# EAGLE design Attenuverting_LinExp_VCA_Top (EAGLE 8.3.2)
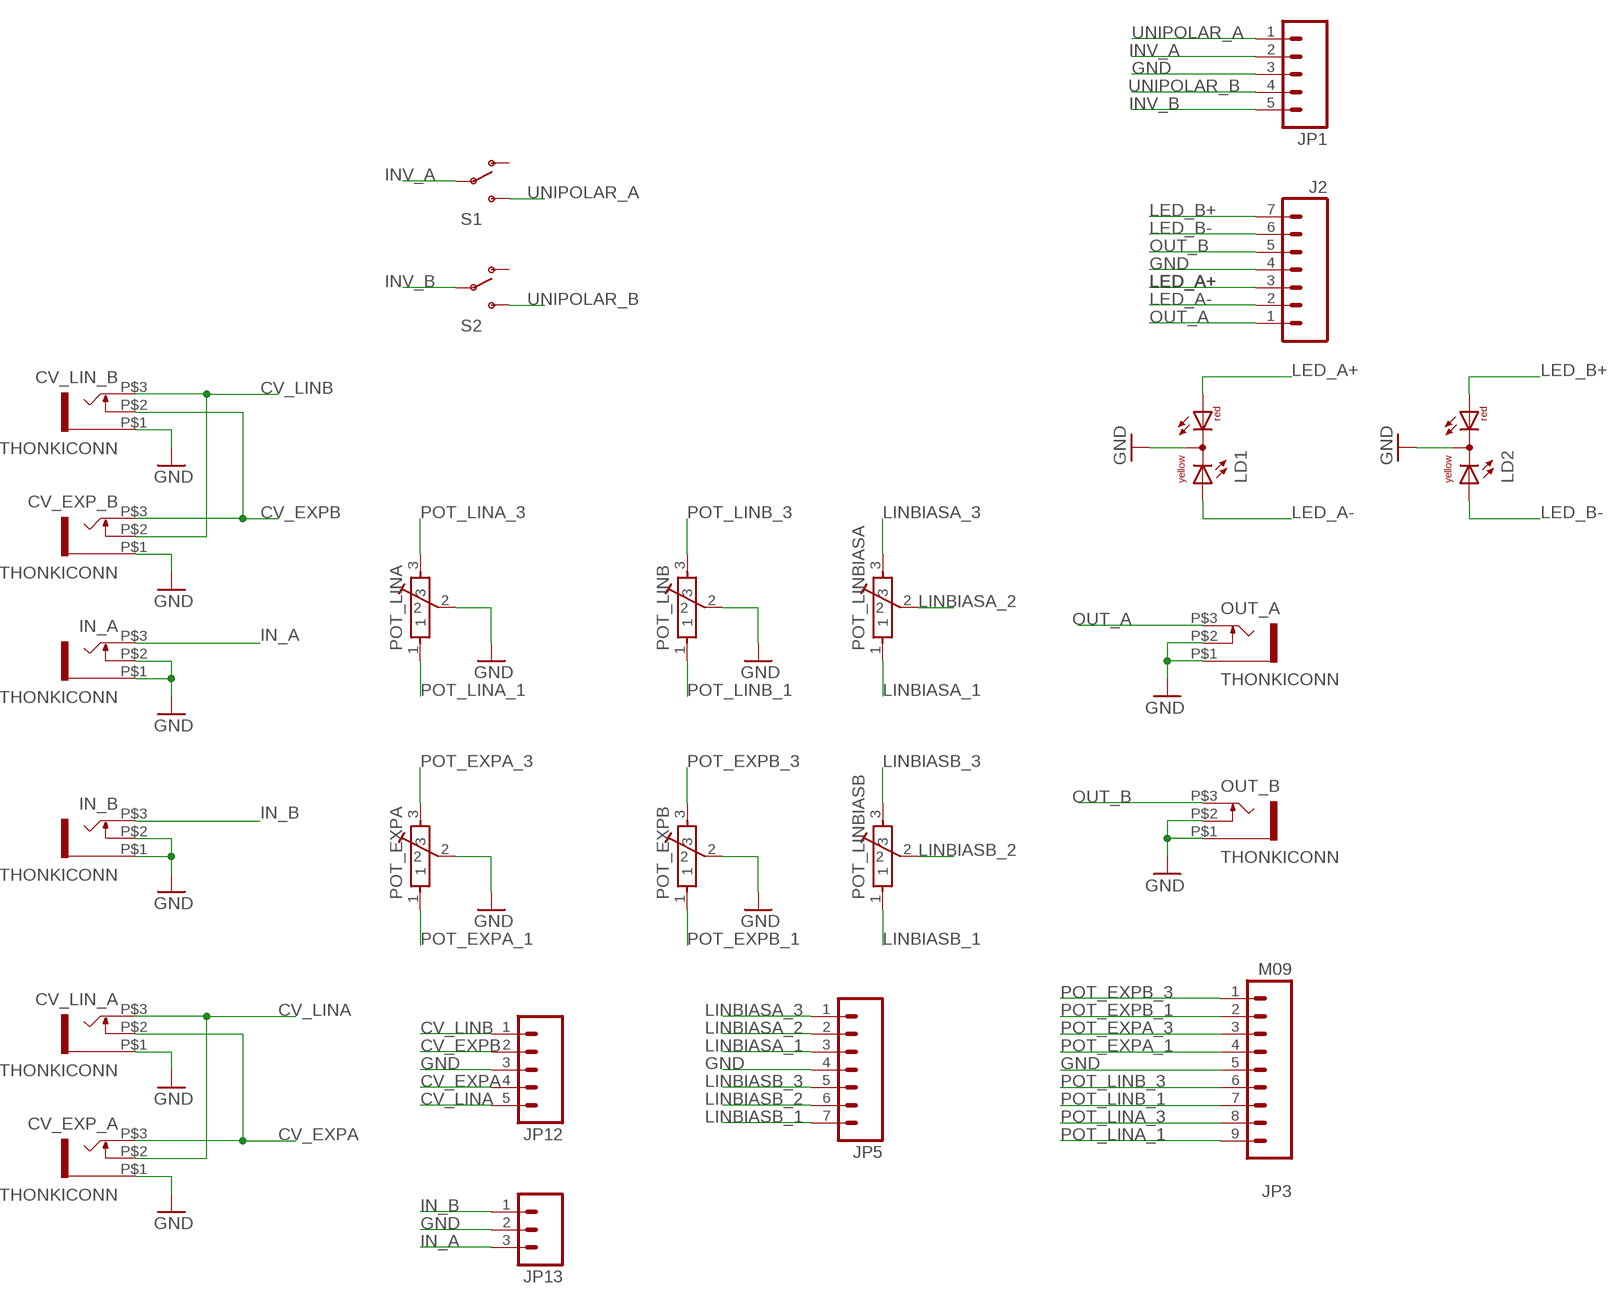
[diagram p0: schematic, sheet 1]

## Parts
CV_EXP_A  THONKICONN  [THONKICONN]
CV_EXP_B  THONKICONN  [THONKICONN]
CV_LIN_A  THONKICONN  [THONKICONN]
CV_LIN_B  THONKICONN  [THONKICONN]
IN_A  THONKICONN  [THONKICONN]
IN_B  THONKICONN  [THONKICONN]
J2  M07  [1X07]
JP1  M05PTH  [1X05]
JP3  M09  [1X09]
JP5  M07  [1X07]
JP12  M05PTH  [1X05]
JP13  M03PTH  [1X03]
LD1  DUOLED-RY-C  [DUOLED-C-5MM]
LD2  DUOLED-RY-C  [DUOLED-C-5MM]
OUT_A  THONKICONN  [THONKICONN]
OUT_B  THONKICONN  [THONKICONN]
POT_EXPA  POT-ALPS-RK09L1140  [POT-ALPS-RK09L1140]
POT_EXPB  POT-ALPS-RK09L1140  [POT-ALPS-RK09L1140]
POT_LINA  POT-ALPS-RK09L1140  [POT-ALPS-RK09L1140]
POT_LINB  POT-ALPS-RK09L1140  [POT-ALPS-RK09L1140]
POT_LINBIASA  POT-ALPS-RK09L1140  [POT-ALPS-RK09L1140]
POT_LINBIASB  POT-ALPS-RK09L1140  [POT-ALPS-RK09L1140]
S1  SWITCH-SPST  [SWITCH-SPDT-SALECOM-T8014]
S2  SWITCH-SPST  [SWITCH-SPDT-SALECOM-T8014]

## Nets
CV_EXPA: CV_EXP_A.P$3 CV_LIN_A.P$2 JP12.4
CV_EXPB: CV_EXP_B.P$3 CV_LIN_B.P$2 JP12.2
CV_LINA: CV_EXP_A.P$2 CV_LIN_A.P$3 JP12.5
CV_LINB: CV_EXP_B.P$2 CV_LIN_B.P$3 JP12.1
GND: CV_EXP_A.P$1 CV_EXP_B.P$1 CV_LIN_A.P$1 CV_LIN_B.P$1 IN_A.P$1 IN_A.P$2 IN_B.P$1 IN_B.P$2 J2.4 JP1.3 JP3.5 JP5.4 JP12.3 JP13.2 LD1.C LD2.C OUT_A.P$1 OUT_A.P$2 OUT_B.P$1 OUT_B.P$2 POT_EXPA.2 POT_EXPB.2 POT_LINA.2 POT_LINB.2
IN_A: IN_A.P$3 JP13.3
IN_B: IN_B.P$3 JP13.1
INV_A: JP1.2 S1.2(P)
INV_B: JP1.5 S2.2(P)
LED_A+: J2.3 LD1.AR
LED_A-: J2.2 LD1.AX(AY)
LED_B+: J2.7 LD2.AR
LED_B-: J2.6 LD2.AX(AY)
LINBIASA_1: JP5.3 POT_LINBIASA.1
LINBIASA_2: JP5.2 POT_LINBIASA.2
LINBIASA_3: JP5.1 POT_LINBIASA.3
LINBIASB_1: JP5.7 POT_LINBIASB.1
LINBIASB_2: JP5.6 POT_LINBIASB.2
LINBIASB_3: JP5.5 POT_LINBIASB.3
OUT_A: J2.1 OUT_A.P$3
OUT_B: J2.5 OUT_B.P$3
POT_EXPA_1: JP3.4 POT_EXPA.1
POT_EXPA_3: JP3.3 POT_EXPA.3
POT_EXPB_1: JP3.2 POT_EXPB.1
POT_EXPB_3: JP3.1 POT_EXPB.3
POT_LINA_1: JP3.9 POT_LINA.1
POT_LINA_3: JP3.8 POT_LINA.3
POT_LINB_1: JP3.7 POT_LINB.1
POT_LINB_3: JP3.6 POT_LINB.3
UNIPOLAR_A: JP1.1 S1.3(S)
UNIPOLAR_B: JP1.4 S2.3(S)
Unconnected: POT_EXPA.P$5 POT_EXPA.P$6 POT_EXPB.P$5 POT_EXPB.P$6 POT_LINA.P$5 POT_LINA.P$6 POT_LINB.P$5 POT_LINB.P$6 POT_LINBIASA.P$5 POT_LINBIASA.P$6 POT_LINBIASB.P$5 POT_LINBIASB.P$6 S1.1(O) S2.1(O)

## Library data of the parts
CV_EXP_A CV_EXP_B CV_LIN_A CV_LIN_B IN_A IN_B OUT_A OUT_B = Rebel:THONKICONN; OC_FARNELL: unknown
J2 JP5 = SparkFun:M07: Header 7 Standard 7-pin 0.1" header. Use with straight break away headers (SKU : PRT-00116), right angle break away headers (PRT-00553), swiss pins (PRT-00743), machine pins (PRT-00117), and female headers (PRT-00115). NOTES ON THE VARIANTS LOCK and LOCK_LONGPADS... This footprint was designed to help hold the alignment of a through-hole component (i.e. 7-pin header) while soldering it into place. You may notice that each hole has been shifted either up or down by 0.005 of an inch from it's more standard position (which is usually a perfectly straight line). This slight alteration caused the pins (the squares in the middle) to touch the edges of the holes. Because they are alternating, it causes a "brace" to hold the header in place. 0.005 has proven to be the perfect amount of "off-center" position when using our standard breakaway headers. Although looks a little odd when you look at the bare footprint, once you have a header in there, the alteration is very hard to notice. Also, if you push a header all the way into place, it is covered up entirely on the bottom side. This idea of altering the position of holes to aid alignment will be further integrated into the Sparkfun Library for other footprints. It can help hold any component with 3 or more connection pins.
JP1 JP12 = SparkFun:M05: Header 5 Standard 5-pin 0.1" header. Use with straight break away headers (SKU : PRT-00116), right angle break away headers (PRT-00553), swiss pins (PRT-00743), machine pins (PRT-00117), and female headers (PRT-00115). Molex polarized connector foot print use with SKU : PRT-08230 with associated crimp pins and housings.
JP3 = SparkFun:M09: Header 9 Standard 9-pin 0.1" header. Use with straight break away headers (SKU : PRT-00116), right angle break away headers (PRT-00553), swiss pins (PRT-00743), machine pins (PRT-00117), and female headers (PRT-00115).
JP13 = SparkFun:M03: Header 3 Standard 3-pin 0.1" header. Use with straight break away headers (SKU : PRT-00116), right angle break away headers (PRT-00553), swiss pins (PRT-00743), machine pins (PRT-00117), and female headers (PRT-00115). Molex polarized connector foot print use with SKU : PRT-08232 with associated crimp pins and housings.
LD1 LD2 = led:DUOLED-RY-C: DUO LED 2 colors (red/yellow), 5 mm, round, common Cathode www.ligitek.com or other producers.
POT_EXPA POT_EXPB POT_LINA POT_LINB POT_LINBIASA POT_LINBIASB = Rebel:POT-ALPS-RK09L
S1 S2 = Rebel:SWITCH-SPST: SPST Switch Simple slide switch. Spark Fun Electronics SKU : COM-00102

## Board
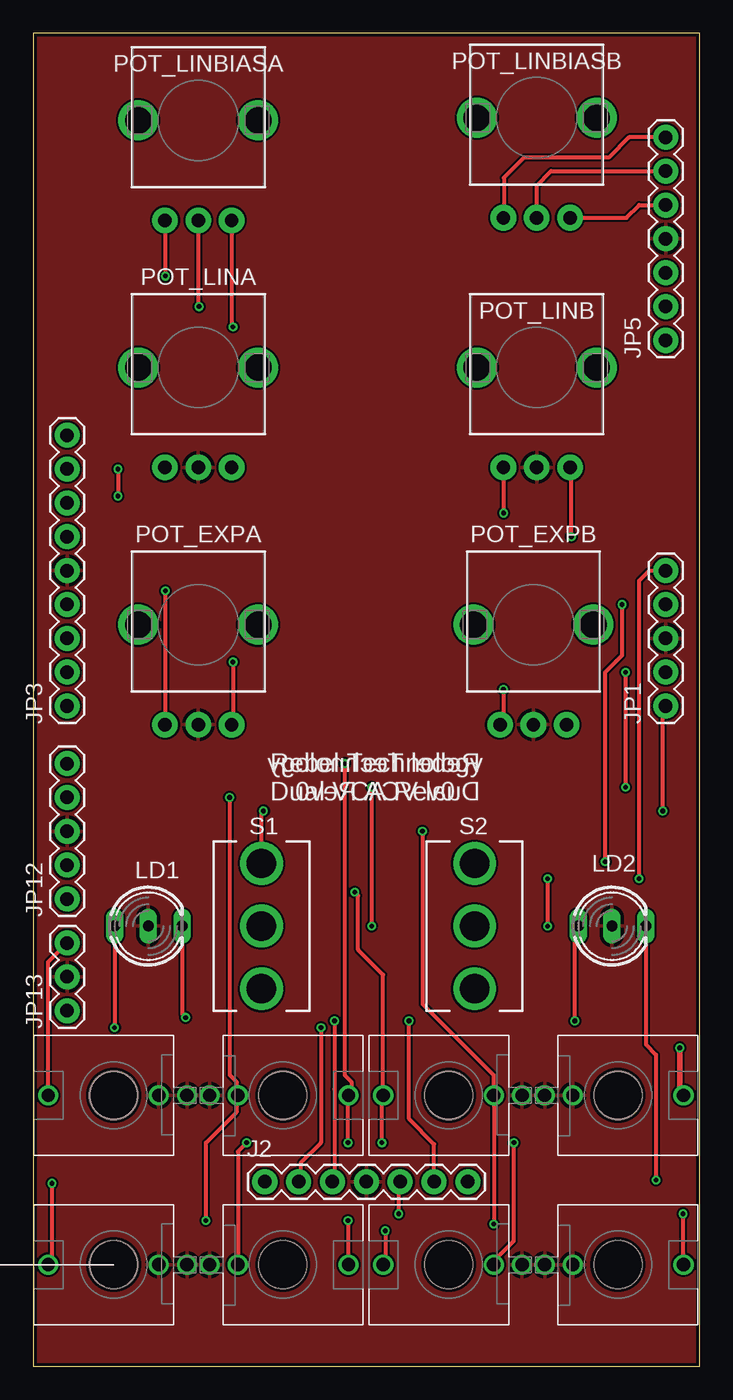
[diagram p1: board, top side]
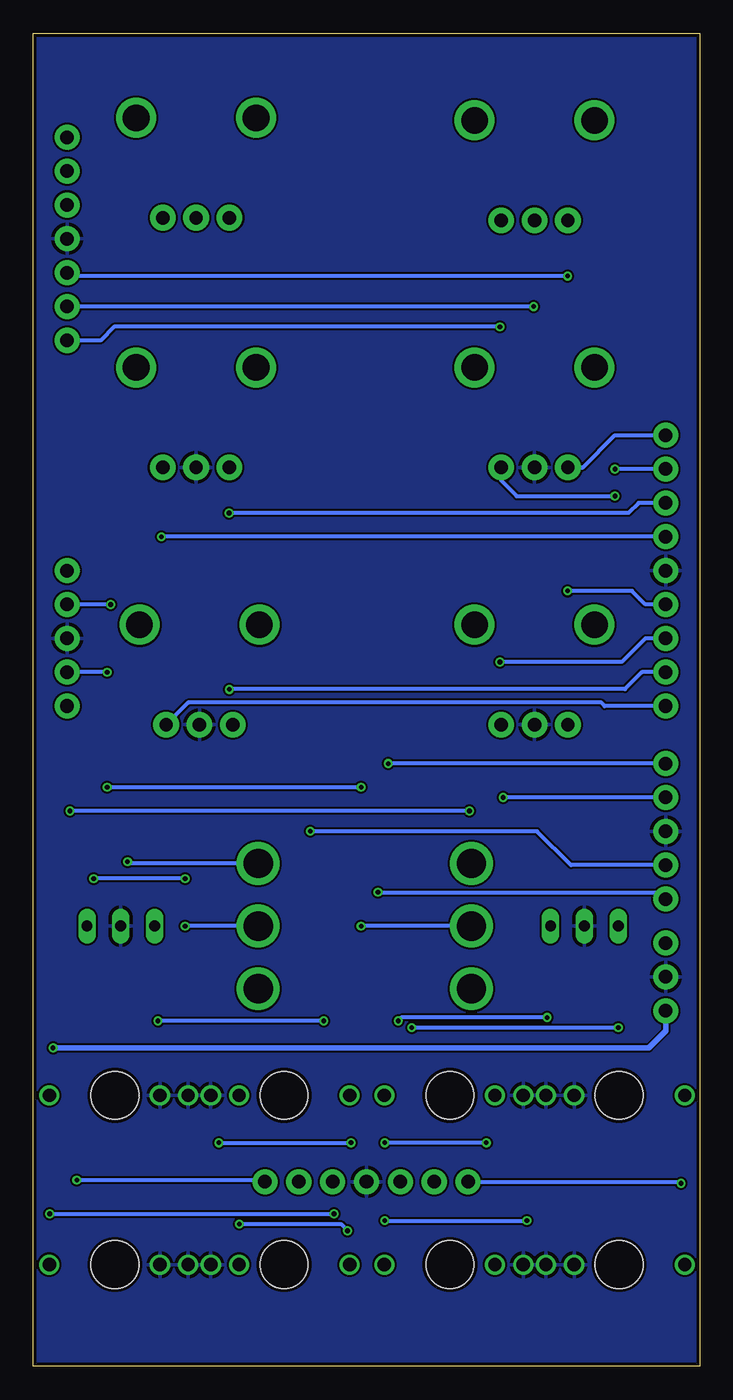
[diagram p2: board, bottom side, seen from below]

Size 50 x 100 mm. Coordinates in mm from the lower left corner, seen from the top.
Outline: 0,0 50,0 50,100 0,100 0,0
Copper layers (1*16): Top 0.035mm / dielectric 1.5mm / Bottom 0.035mm
Design rules "SeeedStudio_2layer_DRU_no_angle_20140221": minimum track width 6mil, minimum drill 12mil, track to track 6mil, track to pad 6mil, pad to pad 6mil, via to via 6mil, smd to smd 0mil, copper to edge 10mil, drill to drill 10mil, minimum pad ring 10mil, minimum via ring 6mil, stop-mask expansion 2mil, vias tented up to drill 100mil, thermal gap 10mil

### Footprints (pad centres in the part's own frame; a part is rotated, then mirrored left to right if it is on the bottom)
THONKICONN = drill 1: P$1 0,-5.5; P$2 0,-3.38; P$3 0,4.92 | hole 3.6: 0,0
1X07 = drill 1.016 pad 1.88: 1 0,0; 2 2.54,0; 3 5.08,0; 4 7.62,0; 5 10.16,0; 6 12.7,0; 7 15.24,0
1X05 = drill 1.016 pad 1.88: 1 0,0; 2 2.54,0; 3 5.08,0; 4 7.62,0; 5 10.16,0
1X09 = drill 1.016 pad 1.88: 1 0,0; 2 2.54,0; 3 5.08,0; 4 7.62,0; 5 10.16,0; 6 12.7,0; 7 15.24,0; 8 17.78,0; 9 20.32,0
1X03 = drill 1.016 pad 1.88: 1 0,0; 2 2.54,0; 3 5.08,0
DUOLED-C-5MM = drill 0.813 long: AR 2.54,0; AX -2.54,0; C 0,0
POT-ALPS-RK09L1140 = drill 1 pad 1.93: 1 -2.5,-7.5; 2 0,-7.5; 3 2.5,-7.5 | drill 2: P$5 -4.5,0; P$6 4.5,0
SWITCH-SPDT-SALECOM-T8014 = drill 2.2: 1 0,4.699; 2 0,0; 3 0,-4.699

### Placement (x,y rotation side)
CV_EXP_A  18.73,7.62 270 top
CV_EXP_B  31.18,7.62 90 top
CV_LIN_A  18.73,20.32 270 top
CV_LIN_B  31.18,20.32 90 top
IN_A  6.03,20.32 90 top
IN_B  43.88,20.32 270 top
J2  17.37,13.84 0 top
JP1  47.46,49.53 90 top
JP3  2.54,49.53 90 top
JP5  47.46,76.96 90 top
JP12  2.54,35.05 90 top
JP13  2.54,26.67 90 top
LD1  8.64,33.02 0 top
LD2  43.43,33.02 0 top
OUT_A  6.03,7.62 90 top
OUT_B  43.88,7.62 270 top
POT_EXPA  12.38,55.63 0 top
POT_EXPB  37.53,55.63 0 top
POT_LINA  12.38,74.93 0 top
POT_LINB  37.78,74.93 0 top
POT_LINBIASA  12.38,93.47 0 top
POT_LINBIASB  37.78,93.66 0 top
S1  17.12,33.02 180 top
S2  33.12,33.02 180 top

### Tracks (layer width: path | path; a pad name or v marks a point on that pad's centre or on a via)
CV_EXPA  (via drill 0.35)
  Top 0.305: CV_EXP_A.P$3 23.65,10.89 v23.62,10.92 | v12.95,10.92 12.95,16.76 15.24,19.05 15.24,20.21 | 15.24,20.21 CV_LIN_A.P$2 | v14.73,42.67 14.73,21.84 15.24,21.34 15.24,20.21
  Bottom 0.305: v23.62,10.92 v12.95,10.92 | JP12.4 v14.73,42.67
CV_EXPB  (via drill 0.35)
  Top 0.305: v29.21,40.13 29.21,27.18 34.54,21.84 34.54,20.33 CV_LIN_B.P$2 34.56,10.68 v34.54,10.67 | v26.42,10.16 26.42,7.78 CV_EXP_B.P$3
  Bottom 0.305: JP12.2 9.65,37.59 12.19,40.13 v29.21,40.13 | v34.54,10.67 26.92,10.67 v26.42,10.16
CV_LINA  (via drill 0.35)
  Top 0.305: CV_EXP_A.P$2 15.35,16.11 v16,16.76 | v23.62,16.76 23.62,20.29 CV_LIN_A.P$3 23.88,20.54 23.88,21.34 23.37,21.84 v23.37,45.21
  Bottom 0.305: v16,16.76 v23.62,16.76 | JP12.5 v23.37,45.21
CV_LINB  (via drill 0.35)
  Top 0.305: v24.13,35.56 24.38,35.31 24.38,31.24 26.26,29.37 CV_LIN_B.P$3 26.16,20.22 v26.16,16.76 | CV_EXP_B.P$2 34.56,7.89 36.07,9.4 v36.07,16.76
  Bottom 0.305: v24.13,35.56 3.05,35.56 JP12.1 | v36.07,16.76 v26.16,16.76
GND
  pour Top: -0.76,101.85 51.31,101.85 51.31,-1.52 -3.05,-1.52 -3.05,101.85
  pour Bottom: -3.81,102.36 52.07,102.36 51.82,-2.29 -4.57,-2.29
IN_A
  Top 0.305: IN_A.P$3 1.11,30.32 JP13.3
IN_B  (via drill 0.35)
  Top 0.406: v48.51,23.88 48.51,20.61 IN_B.P$3
  Bottom 0.406: JP13.1 2.54,25.15 3.81,23.88 v48.51,23.88
INV_A  (via drill 0.35)
  Top 0.305: v25.4,33.02 v25.4,43.43 | v44.45,43.43 v44.45,52.07
  Bottom 0.305: S1.2 v25.4,33.02 | v25.4,43.43 v44.45,43.43 | v44.45,52.07 JP1.2
INV_B  (via drill 0.35)
  Top 0.305: v38.61,33.02 v38.61,36.58 | v45.47,36.58 45.47,58.93 46.23,59.69 JP1.5
  Bottom 0.305: S2.2 v38.61,33.02 | v38.61,36.58 v45.47,36.58
LED_A+  (via drill 0.35)
  Top 0.305: LD1.AR 11.18,26.42 v11.43,26.16 | v22.61,25.91 22.61,20.77 22.59,20.76 22.59,13.98 J2.3
  Bottom 0.305: v11.43,26.16 22.35,26.16 v22.61,25.91
LED_A-  (via drill 0.35)
  Top 0.305: LD1.AX v6.1,25.4 | v21.59,25.4 21.59,16.76 20.07,15.24 20.07,13.99 J2.2
  Bottom 0.305: v6.1,25.4 v21.59,25.4
LED_B+  (via drill 0.35)
  Top 0.305: LD2.AR 45.97,24.13 46.74,23.37 v46.74,13.97
  Bottom 0.305: v46.74,13.97 32.74,13.97 J2.7
LED_B-  (via drill 0.35)
  Top 0.305: J2.6 30.07,16.66 28.19,18.54 v28.19,25.91 | v40.64,25.91 40.64,32.77 LD2.AX
  Bottom 0.305: v28.19,25.91 v40.64,25.91
LINBIASA_1  (via drill 0.35)
  Top 0.305: POT_LINBIASA.1 9.88,81.81 v9.91,81.79
  Bottom 0.305: v9.91,81.79 47.21,81.79 JP5.3
LINBIASA_2  (via drill 0.35)
  Top 0.305: POT_LINBIASA.2 12.38,79.57 v12.45,79.5
  Bottom 0.305: v12.45,79.5 JP5.2
LINBIASA_3  (via drill 0.35)
  Top 0.305: POT_LINBIASA.3 14.88,78.08 v14.99,77.98
  Bottom 0.305: v14.99,77.98 43.94,77.98 44.96,76.96 JP5.1
LINBIASB_1
  Top 0.305: JP5.7 44.7,92.2 43.18,90.68 36.83,90.68 35.31,89.15 35.31,86.19 POT_LINBIASB.1
LINBIASB_2
  Top 0.305: POT_LINBIASB.2 37.78,88.58 38.86,89.66 JP5.6
LINBIASB_3
  Top 0.305: POT_LINBIASB.3 44.51,86.16 45.47,87.12 JP5.5
OUT_A  (via drill 0.35)
  Top 0.152: OUT_A.P$3 1.17,7.68
  Top 0.305: v1.39,13.72 1.39,7.9 1.17,7.68
  Bottom 0.305: J2.1 1.52,13.84 v1.39,13.72
OUT_B  (via drill 0.35)
  Top 0.305: OUT_B.P$3 48.8,11.4 v48.77,11.43 | v27.43,11.43 27.43,13.74 J2.5
  Bottom 0.305: v48.77,11.43 v27.43,11.43
POT_EXPA_1  (via drill 0.35)
  Top 0.305: v9.91,58.17 9.91,48.15 POT_EXPA.1
  Bottom 0.305: JP3.4 4.06,57.15 5.08,58.17 v9.91,58.17
POT_EXPA_3  (via drill 0.35)
  Top 0.305: v14.99,52.83 14.99,48.23 POT_EXPA.3
  Bottom 0.305: JP3.3 4.06,54.61 5.84,52.83 v14.99,52.83
POT_EXPB_1  (via drill 0.35)
  Top 0.152: 35.31,50.8 v35.28,50.78
  Top 0.305: v35.28,50.78 35.28,48.38 POT_EXPB.1
  Bottom 0.305: JP3.2 4.32,52.07 5.59,50.8 35.26,50.8 v35.28,50.78
POT_EXPB_3
  Bottom 0.305: JP3.1 7.11,49.53 7.37,49.78 38.37,49.78 POT_EXPB.3
POT_LINA_1
  Bottom 0.305: POT_LINA.1 8.77,67.43 6.35,69.85 JP3.9
POT_LINA_3  (via drill 0.35)
  Top 0.305: v6.35,67.31 v6.35,65.28
  Bottom 0.305: JP3.8 v6.35,67.31 | POT_LINA.3 14.88,66.44 13.72,65.28 v6.35,65.28
POT_LINB_1  (via drill 0.35)
  Top 0.305: v35.31,64.01 35.31,67.41 POT_LINB.1
  Bottom 0.305: JP3.7 4.57,64.77 5.33,64.01 v35.31,64.01
POT_LINB_3  (via drill 0.35)
  Top 0.305: v40.39,62.23 40.39,67.33 POT_LINB.3
  Bottom 0.305: JP3.6 v40.39,62.23
UNIPOLAR_A  (via drill 0.35)
  Top 0.305: S1.3 17.12,41.5 v17.27,41.66 | v47.24,41.66 47.24,49.31 JP1.1
  Bottom 0.305: v17.27,41.66 v47.24,41.66
UNIPOLAR_B  (via drill 0.35)
  Top 0.305: v42.93,37.85 42.93,52.07 44.2,53.34 v44.2,57.15
  Bottom 0.305: S2.3 42.8,37.72 v42.93,37.85 | v44.2,57.15 JP1.4

### Text on the board
tPlace: Rebel Technology / Dual VCA Rev0 | Rebel Technology / Dual VCA Rev0